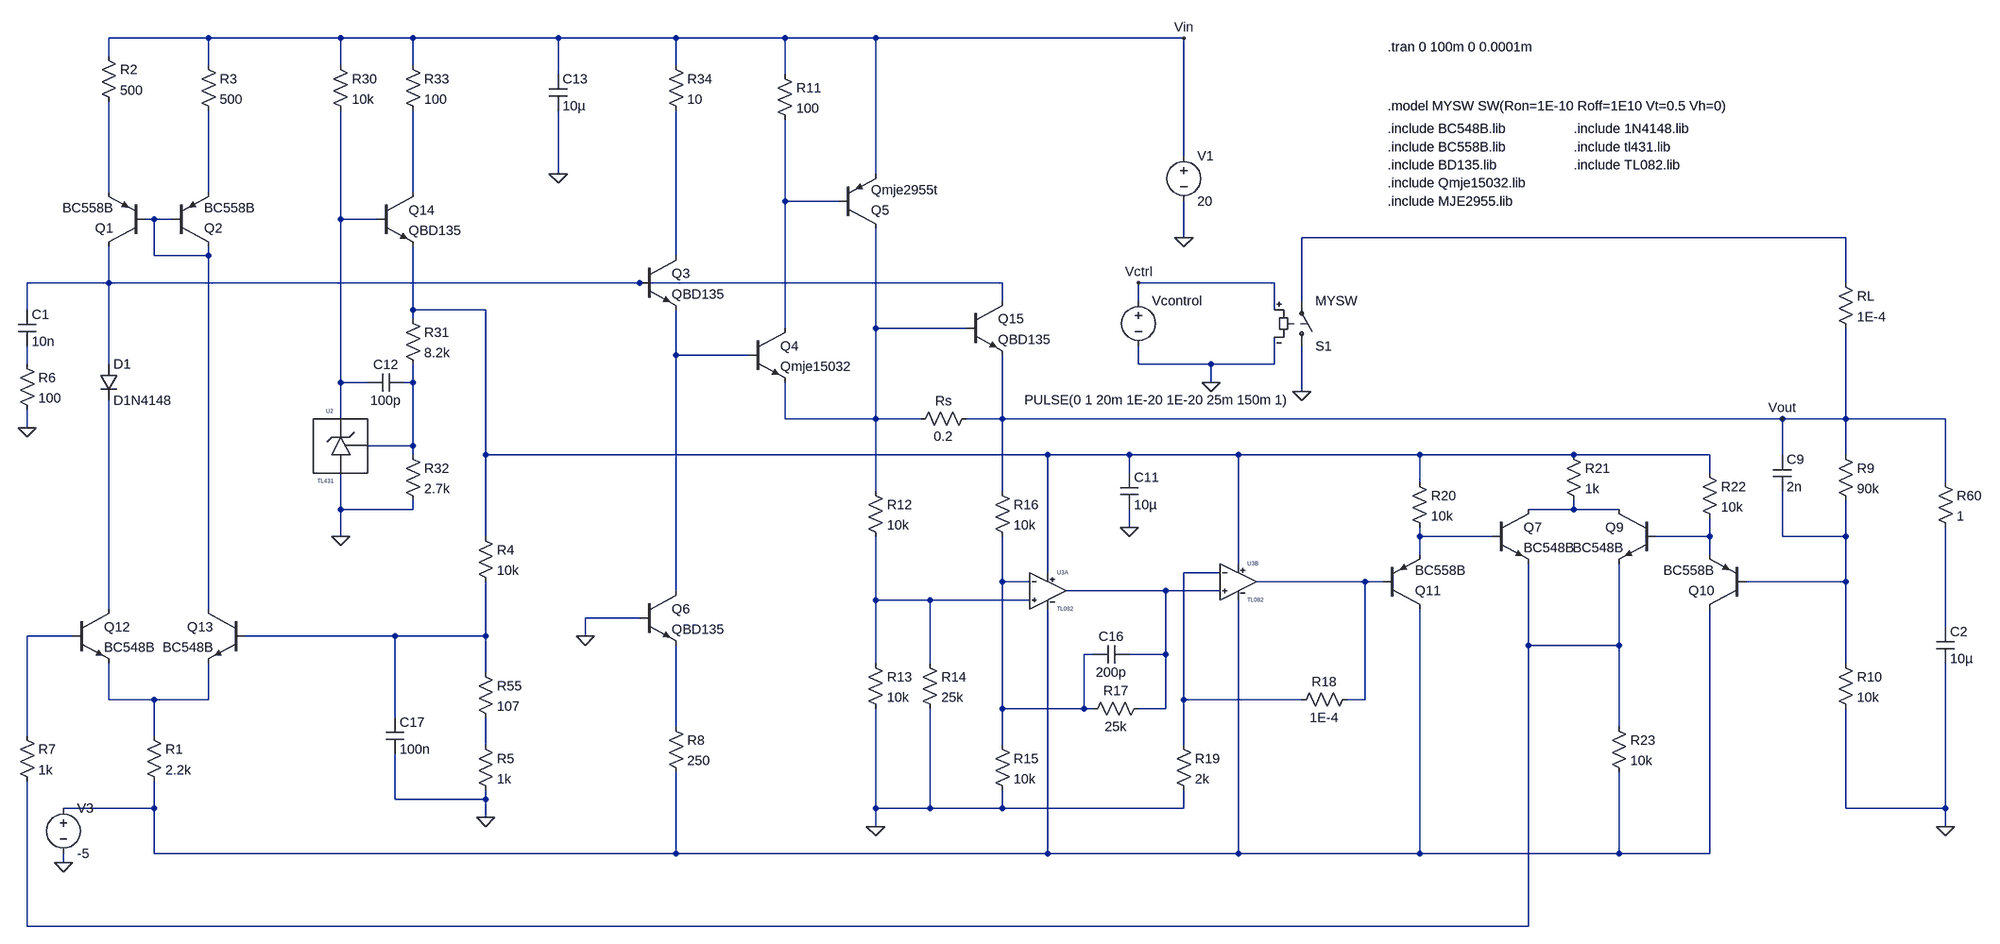
[diagram p0: schematic power_supply.asc]
power_supply.asc, the LTspice schematic file:
Version 4
SHEET 1 3040 1240
WIRE -1616 -752 -1792 -752
WIRE -1328 -752 -1616 -752
WIRE -1200 -752 -1328 -752
WIRE -944 -752 -1200 -752
WIRE -736 -752 -944 -752
WIRE -544 -752 -736 -752
WIRE -384 -752 -544 -752
WIRE 160 -752 -384 -752
WIRE -1792 -720 -1792 -752
WIRE -1616 -704 -1616 -752
WIRE -1328 -704 -1328 -752
WIRE -1200 -704 -1200 -752
WIRE -736 -704 -736 -752
WIRE -944 -688 -944 -752
WIRE -544 -688 -544 -752
WIRE 160 -544 160 -752
WIRE -944 -512 -944 -624
WIRE -384 -512 -384 -752
WIRE -1792 -480 -1792 -640
WIRE -1616 -480 -1616 -624
WIRE -1200 -480 -1200 -624
WIRE -544 -464 -544 -608
WIRE -448 -464 -544 -464
WIRE -1712 -432 -1728 -432
WIRE -1680 -432 -1712 -432
WIRE -1328 -432 -1328 -624
WIRE -1264 -432 -1328 -432
WIRE 160 -400 160 -464
WIRE 1328 -400 368 -400
WIRE -1712 -368 -1712 -432
WIRE -1616 -368 -1616 -384
WIRE -1616 -368 -1712 -368
WIRE -736 -368 -736 -624
WIRE -1792 -320 -1792 -384
WIRE -1792 -320 -1936 -320
WIRE -800 -320 -1792 -320
WIRE -160 -320 -800 -320
WIRE 320 -320 80 -320
WIRE 1328 -320 1328 -400
WIRE -160 -288 -160 -320
WIRE 80 -288 80 -320
WIRE 368 -288 368 -400
WIRE -1936 -272 -1936 -320
WIRE -1200 -272 -1200 -384
WIRE -1072 -272 -1200 -272
WIRE 320 -272 320 -320
WIRE -1200 -256 -1200 -272
WIRE -544 -240 -544 -464
WIRE -384 -240 -384 -416
WIRE -224 -240 -384 -240
WIRE -736 -192 -736 -272
WIRE -608 -192 -736 -192
WIRE -1936 -176 -1936 -208
WIRE -1792 -176 -1792 -320
WIRE 80 -176 80 -208
WIRE 208 -176 80 -176
WIRE 320 -176 320 -224
WIRE 320 -176 208 -176
WIRE -1328 -144 -1328 -432
WIRE -1280 -144 -1328 -144
WIRE -1200 -144 -1200 -176
WIRE -1200 -144 -1216 -144
WIRE 208 -144 208 -176
WIRE 368 -128 368 -208
WIRE -1328 -80 -1328 -144
WIRE -544 -80 -544 -144
WIRE -384 -80 -384 -240
WIRE -384 -80 -544 -80
WIRE -304 -80 -384 -80
WIRE -160 -80 -160 -192
WIRE -160 -80 -224 -80
WIRE 1216 -80 -160 -80
WIRE 1328 -80 1328 -240
WIRE 1328 -80 1216 -80
WIRE 1504 -80 1328 -80
WIRE -1936 -64 -1936 -96
WIRE -1200 -32 -1200 -144
WIRE -1200 -32 -1280 -32
WIRE -1200 -16 -1200 -32
WIRE -1072 -16 -1072 -272
WIRE -80 -16 -1072 -16
WIRE 64 -16 -80 -16
WIRE 256 -16 64 -16
WIRE 576 -16 256 -16
WIRE 848 -16 576 -16
WIRE 1088 -16 848 -16
WIRE 1216 -16 1216 -80
WIRE 1328 -16 1328 -80
WIRE 64 16 64 -16
WIRE 1088 16 1088 -16
WIRE 576 32 576 -16
WIRE 1504 32 1504 -80
WIRE -384 48 -384 -80
WIRE -160 48 -160 -80
WIRE -1328 80 -1328 16
WIRE -1200 80 -1200 64
WIRE -1200 80 -1328 80
WIRE 848 80 848 64
WIRE 848 80 768 80
WIRE 928 80 848 80
WIRE 64 112 64 80
WIRE -1328 128 -1328 80
WIRE -1072 128 -1072 -16
WIRE 576 128 576 112
WIRE 704 128 576 128
WIRE 1088 128 1088 96
WIRE 1088 128 992 128
WIRE 1216 128 1216 48
WIRE 1328 128 1328 64
WIRE 1328 128 1216 128
WIRE 576 160 576 128
WIRE 1088 160 1088 128
WIRE 256 176 256 -16
WIRE -80 192 -80 -16
WIRE 224 192 160 192
WIRE -160 208 -160 128
WIRE -112 208 -160 208
WIRE 480 208 288 208
WIRE 512 208 480 208
WIRE 1328 208 1328 128
WIRE 1328 208 1152 208
WIRE -736 224 -736 -192
WIRE 128 224 -48 224
WIRE 224 224 128 224
WIRE -384 240 -384 128
WIRE -288 240 -384 240
WIRE -112 240 -288 240
WIRE -1792 256 -1792 -112
WIRE -1616 256 -1616 -368
WIRE -800 272 -896 272
WIRE 1504 288 1504 112
WIRE -1856 304 -1936 304
WIRE -1232 304 -1552 304
WIRE -1072 304 -1072 208
WIRE -1072 304 -1232 304
WIRE -896 304 -896 272
WIRE 768 320 768 176
WIRE 928 320 928 176
WIRE 928 320 768 320
WIRE 0 336 -16 336
WIRE 128 336 128 224
WIRE 128 336 64 336
WIRE -384 352 -384 240
WIRE -288 352 -288 240
WIRE 1328 352 1328 208
WIRE -1072 368 -1072 304
WIRE -1792 416 -1792 352
WIRE -1712 416 -1792 416
WIRE -1616 416 -1616 352
WIRE -1616 416 -1712 416
WIRE 160 416 160 192
WIRE 368 416 160 416
WIRE 480 416 480 208
WIRE 480 416 448 416
WIRE -160 432 -160 208
WIRE -16 432 -16 336
WIRE -16 432 -160 432
WIRE 0 432 -16 432
WIRE 128 432 128 336
WIRE 128 432 80 432
WIRE -1232 448 -1232 304
WIRE -736 464 -736 320
WIRE 928 464 928 320
WIRE -1936 480 -1936 304
WIRE -1712 480 -1712 416
WIRE -1072 496 -1072 448
WIRE -160 496 -160 432
WIRE 160 496 160 416
WIRE -1232 592 -1232 512
WIRE -1072 592 -1072 576
WIRE -1072 592 -1232 592
WIRE -1712 608 -1712 560
WIRE -1712 608 -1872 608
WIRE -384 608 -384 432
WIRE -288 608 -288 432
WIRE -288 608 -384 608
WIRE -160 608 -160 576
WIRE -160 608 -288 608
WIRE 160 608 160 576
WIRE 160 608 -160 608
WIRE 1328 608 1328 432
WIRE 1504 608 1504 352
WIRE 1504 608 1328 608
WIRE -1072 624 -1072 592
WIRE -384 640 -384 608
WIRE 1504 640 1504 608
WIRE -1712 688 -1712 608
WIRE -736 688 -736 544
WIRE -736 688 -1712 688
WIRE -80 688 -80 256
WIRE -80 688 -736 688
WIRE 256 688 256 240
WIRE 256 688 -80 688
WIRE 576 688 576 256
WIRE 576 688 256 688
WIRE 928 688 928 544
WIRE 928 688 576 688
WIRE 1088 688 1088 256
WIRE 1088 688 928 688
WIRE -1872 704 -1872 688
WIRE -1936 816 -1936 560
WIRE 768 816 768 320
WIRE 768 816 -1936 816
FLAG -384 640 0
FLAG 1504 640 0
FLAG 160 -400 0
FLAG -944 -512 0
FLAG -896 304 0
FLAG 64 112 0
FLAG -1072 624 0
FLAG -1936 -64 0
FLAG -1328 128 0
FLAG -1872 704 0
FLAG 208 -144 0
FLAG 368 -128 0
FLAG 1216 -80 Vout
FLAG 160 -752 Vin
FLAG 80 -320 Vctrl
DATAFLAG -1920 304 ""
DATAFLAG -1488 304 ""
DATAFLAG -1792 160 ""
DATAFLAG -1792 -240 ""
DATAFLAG -1616 -240 ""
DATAFLAG -976 -16 ""
DATAFLAG 1472 -80 ""
DATAFLAG -1328 -432 ""
DATAFLAG -1712 416 ""
DATAFLAG -1200 -544 ""
DATAFLAG -736 112 "Ic(Q6)"
DATAFLAG -736 -176 ""
DATAFLAG -736 416 ""
DATAFLAG -384 240 ""
DATAFLAG -160 320 ""
DATAFLAG 32 224 ""
DATAFLAG 160 432 ""
DATAFLAG 368 208 ""
DATAFLAG 656 128 ""
DATAFLAG 768 272 ""
DATAFLAG 928 80 ""
DATAFLAG 1040 128 ""
DATAFLAG 1216 208 ""
DATAFLAG 448 688 ""
DATAFLAG -128 -752 ""
DATAFLAG -736 -512 ""
DATAFLAG -544 -496 ""
DATAFLAG -384 -160 ""
DATAFLAG -1792 -560 ""
DATAFLAG -1616 -544 ""
DATAFLAG -1616 0 "Ic(Q13)"
DATAFLAG -1792 -16 "Ic(Q12)"
DATAFLAG -384 -368 "Ic(Q5)"
DATAFLAG 1328 -208 "-I(RL)"
DATAFLAG -1200 -304 "-Ie(Q14)"
DATAFLAG -1072 80 "I(R4)"
DATAFLAG -1328 -224 "Ix(U2:CATHODE)"
SYMBOL TL082 -80 160 R0
SYMATTR InstName U3A
SYMBOL res 96 416 R90
WINDOW 0 0 56 VBottom 2
WINDOW 3 32 56 VTop 2
SYMATTR InstName R17
SYMATTR Value 25k
SYMBOL cap 64 320 R90
WINDOW 0 0 32 VBottom 2
WINDOW 3 32 32 VTop 2
SYMATTR InstName C16
SYMATTR Value 200p
SYMBOL res -176 32 R0
SYMATTR InstName R16
SYMATTR Value 10k
SYMBOL res -176 480 R0
SYMATTR InstName R15
SYMATTR Value 10k
SYMBOL res -208 -96 R90
WINDOW 0 0 56 VBottom 2
WINDOW 3 32 56 VTop 2
SYMATTR InstName Rs
SYMATTR Value 0.2
SYMBOL TL082 256 144 R0
SYMATTR InstName U3B
SYMBOL res 144 480 R0
SYMATTR InstName R19
SYMATTR Value 2k
SYMBOL res -304 336 R0
SYMATTR InstName R14
SYMATTR Value 25k
SYMBOL res -400 336 R0
SYMATTR InstName R13
SYMATTR Value 10k
SYMBOL res -400 32 R0
SYMATTR InstName R12
SYMATTR Value 10k
SYMBOL res 560 16 R0
SYMATTR InstName R20
SYMATTR Value 10k
SYMBOL npn 704 80 R0
SYMATTR InstName Q7
SYMATTR Value BC548B
SYMBOL npn 992 80 M0
SYMATTR InstName Q9
SYMATTR Value BC548B
SYMBOL res 832 -32 R0
SYMATTR InstName R21
SYMATTR Value 1k
SYMBOL res 912 448 R0
SYMATTR InstName R23
SYMATTR Value 10k
SYMBOL res 1072 0 R0
SYMATTR InstName R22
SYMATTR Value 10k
SYMBOL pnp 512 256 M180
SYMATTR InstName Q11
SYMATTR Value BC558B
SYMBOL pnp 1152 256 R180
SYMATTR InstName Q10
SYMATTR Value BC558B
SYMBOL res 1312 -32 R0
SYMATTR InstName R9
SYMATTR Value 90k
SYMBOL cap 1200 -16 R0
SYMATTR InstName C9
SYMATTR Value 2n
SYMBOL res 1312 336 R0
SYMATTR InstName R10
SYMATTR Value 10k
SYMBOL cap 1488 288 R0
SYMATTR InstName C2
SYMATTR Value 10µ
SYMBOL res 1488 16 R0
SYMATTR InstName R60
SYMATTR Value 1
SYMBOL pnp -448 -416 M180
SYMATTR InstName Q5
SYMATTR Value Qmje2955t
SYMBOL voltage 160 -560 R0
SYMATTR InstName V1
SYMATTR Value 20
SYMBOL res -560 -704 R0
SYMATTR InstName R11
SYMATTR Value 100
SYMBOL npn -608 -240 R0
SYMATTR InstName Q4
SYMATTR Value Qmje15032
SYMBOL npn -800 -368 R0
SYMATTR InstName Q3
SYMATTR Value QBD135
SYMBOL cap -960 -688 R0
SYMATTR InstName C13
SYMATTR Value 10µ
SYMBOL npn -800 224 R0
SYMATTR InstName Q6
SYMATTR Value QBD135
SYMBOL res -752 448 R0
SYMATTR InstName R8
SYMATTR Value 250
SYMBOL cap 48 16 R0
SYMATTR InstName C11
SYMATTR Value 10µ
SYMBOL res -1088 112 R0
SYMATTR InstName R4
SYMATTR Value 10k
SYMBOL res -1088 352 R0
SYMATTR InstName R55
SYMATTR Value 107
SYMBOL res -1088 480 R0
SYMATTR InstName R5
SYMATTR Value 1k
SYMBOL cap -1248 448 R0
SYMATTR InstName C17
SYMATTR Value 100n
SYMBOL npn -1856 256 R0
SYMATTR InstName Q12
SYMATTR Value BC548B
SYMBOL npn -1552 256 M0
SYMATTR InstName Q13
SYMATTR Value BC548B
SYMBOL res -1728 464 R0
SYMATTR InstName R1
SYMATTR Value 2.2k
SYMBOL diode -1808 -176 R0
SYMATTR InstName D1
SYMATTR Value D1N4148
SYMBOL pnp -1728 -384 R180
SYMATTR InstName Q1
SYMATTR Value BC558B
SYMBOL pnp -1680 -384 M180
SYMATTR InstName Q2
SYMATTR Value BC558B
SYMBOL res -1808 -736 R0
SYMATTR InstName R2
SYMATTR Value 500
SYMBOL res -1632 -720 R0
SYMATTR InstName R3
SYMATTR Value 500
SYMBOL cap -1952 -272 R0
SYMATTR InstName C1
SYMATTR Value 10n
SYMBOL res -1952 -192 R0
SYMATTR InstName R6
SYMATTR Value 100
SYMBOL res -1344 -720 R0
SYMATTR InstName R30
SYMATTR Value 10k
SYMBOL npn -1264 -480 R0
SYMATTR InstName Q14
SYMATTR Value QBD135
SYMBOL res -1216 -272 R0
SYMATTR InstName R31
SYMATTR Value 8.2k
SYMBOL res -1216 -32 R0
SYMATTR InstName R32
SYMATTR Value 2.7k
SYMBOL cap -1216 -160 R90
WINDOW 0 0 32 VBottom 2
WINDOW 3 32 32 VTop 2
SYMATTR InstName C12
SYMATTR Value 100p
SYMBOL TL431 -1328 -32 M0
SYMATTR InstName U2
SYMBOL res -1952 464 R0
SYMATTR InstName R7
SYMATTR Value 1k
SYMBOL res 1312 -336 R0
SYMATTR InstName RL
SYMATTR Value 1E-4
SYMBOL voltage -1872 592 R0
SYMATTR InstName V3
SYMATTR Value -5
SYMBOL res -1216 -720 R0
SYMATTR InstName R33
SYMATTR Value 100
SYMBOL res -752 -720 R0
SYMATTR InstName R34
SYMATTR Value 10
SYMBOL sw 368 -192 M180
SYMATTR InstName S1
SYMATTR Value MYSW
SYMBOL voltage 80 -304 R0
WINDOW 3 -201 191 Left 2
WINDOW 123 0 0 Left 0
WINDOW 39 0 0 Left 0
SYMATTR Value PULSE(0 1 20m 1E-20 1E-20 25m 150m 1)
SYMATTR InstName Vcontrol
SYMBOL npn -224 -288 R0
SYMATTR InstName Q15
SYMATTR Value QBD135
SYMBOL res 464 400 R90
WINDOW 0 0 56 VBottom 2
WINDOW 3 32 56 VTop 2
SYMATTR InstName R18
SYMATTR Value 1E-4
TEXT 520 -560 Left 2 !.include BC558B.lib
TEXT 848 -528 Left 2 !.include TL082.lib
TEXT 520 -592 Left 2 !.include BC548B.lib
TEXT 520 -464 Left 2 !.include MJE2955.lib
TEXT 520 -528 Left 2 !.include BD135.lib
TEXT 848 -592 Left 2 !.include 1N4148.lib
TEXT 848 -560 Left 2 !.include tl431.lib
TEXT 520 -496 Left 2 !.include Qmje15032.lib
TEXT 520 -736 Left 2 !.tran 0 100m 0 0.0001m
TEXT 520 -632 Left 2 !.model MYSW SW(Ron=1E-10 Roff=1E10 Vt=0.5 Vh=0)

The netlist it stands for:
* power_supply.asc
XU3A N023 N020 N010 N032 N022 TL082  ; pins In+ In- V+ V- OUT
R17 N022 N020 25k
C16 N022 N020 200p
R16 Vout N020 10k
R15 N020 0 10k
Rs Vout N011 0.2
XU3B N022 N019 N010 N032 N021 TL082  ; pins In+ In- V+ V- OUT
R19 N019 0 2k
R14 N023 0 25k
R13 N023 0 10k
R12 N011 N023 10k
R20 N010 N016 10k
Q7 N015 N016 N028 0 BC548B
Q9 N015 N017 N028 0 BC548B
R21 N010 N015 1k
R23 N028 N032 10k
R22 N010 N017 10k
Q11 N032 N021 N016 0 BC558B
Q10 N032 N018 N017 0 BC558B
R9 Vout N018 90k
C9 Vout N018 2n
R10 N018 0 10k
C2 N025 0 10µ
R60 Vout N025 1
Q5 N011 N004 Vin 0 Qmje2955t
V1 Vin 0 20
R11 Vin N004 100
Q4 N004 N012 N011 0 Qmje15032
Q3 N008 N009 N012 0 QBD135
C13 Vin 0 10µ
Q6 N012 0 N030 0 QBD135
R8 N030 N032 250
C11 N010 0 10µ
R4 N010 N027 10k
R55 N027 N031 107
R5 N031 0 1k
C17 N027 0 100n
Q12 N024 N026 N029 0 BC548B
Q13 N005 N027 N029 0 BC548B
R1 N029 N032 2.2k
D1 N009 N024 D1N4148
Q1 N009 N005 N001 0 BC558B
Q2 N005 N005 N002 0 BC558B
R2 Vin N001 500
R3 Vin N002 500
C1 N009 N013 10n
R6 N013 0 100
R30 Vin N006 10k
Q14 N003 N006 N010 0 QBD135
R31 N010 N014 8.2k
R32 N014 0 2.7k
C12 N014 N006 100p
XU2 N006 0 N014 TL431  ; pins CATHODE ANODE REF
R7 N026 N028 1k
RL N007 Vout 1E-4
V3 N032 0 -5
R33 Vin N003 100
R34 Vin N008 10
S1 0 N007 Vctrl 0 MYSW
Vcontrol Vctrl 0 PULSE(0 1 20m 1E-20 1E-20 25m 150m 1)
Q15 N009 N011 Vout 0 QBD135
R18 N021 N019 1E-4
.model D D
.lib standard.dio
.model NPN NPN
.model PNP PNP
.lib standard.bjt
.include BC558B.lib
.include TL082.lib
.include BC548B.lib
.include MJE2955.lib
.include BD135.lib
.include 1N4148.lib
.include tl431.lib
.include Qmje15032.lib
.tran 0 100m 0 0.0001m
.model MYSW SW(Ron=1E-10 Roff=1E10 Vt=0.5 Vh=0)
.lib TL082.lib
.lib tl431.lib
.backanno
.end